# Altium schematic sheet Encoders.SchDoc: Title
size A4; Date: *******; ApprovedBy: *******; CheckedBy: Yasiru Banayake; Author: *******; CompanyName: *******; DrawnBy: Name; Engineer: *******; Organization: *******; Address1: *******; Address2: *******; Address3: *******; Address4: *******; DocumentNumber: Doc Num; Revision: *******; SheetNumber: 4; SheetTotal: 11; Subtitle: Encoder JST; Project: Resturant Robot; VersionRevision: III; TotalSheet: 11; CurrentTime: *******; CurrentDate: *******; Time: *******; DocumentFullPathAndName: *******; DocumentName: *******; ModifiedDate: *******; ImagePath: *******; ProjectName: *******; Application_BuildNumber: *******
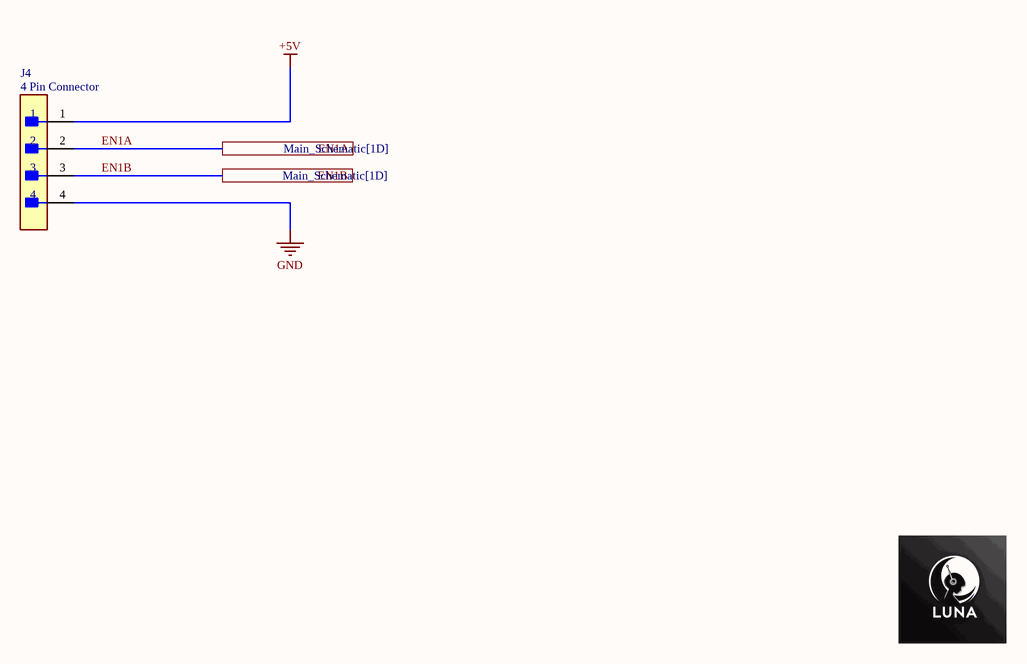
[diagram p0: Encoders.SchDoc]

## Parts
J4  4 Pin Connector  [FP-B4B-XH-A_LF_SN-MFG]

## Ports
EN1A (see Main_Schematic[1D]), EN1B (see Main_Schematic[1D])

## Nets
+5V: J4.1
GND: J4.4
EN1A: J4.2 ; port EN1A
EN1B: J4.3 ; port EN1B

## Notes on the sheet
- Title:
- Drawn By:
- Page Contents:
- Checked By:
- Subtitle:
- University Of Moratuwa
- Moratuwa
- Size:
- Date:
- File:
- Email:
- A4
- lasithnawanjaan123@gmail.com
- Lasith Haputhanthri
- Number:
- Time:
- Revision:
- Sheet
- of
- Katubedda
- 10500
- Sri Lanka

## Library data of the parts
J4 = CMP-17439-000250-1: CONN HEADER VERT 4POS 2.5MM; Number of Contacts: 4; Contact Resistance: 20mR; Voltage Rating: 250V; Max Current Rating: 3A; Gender: Male; Wire/Cable Gauge: 22AWG; Mated Stacking Heights: 9.8mm; Insulation Resistance: 1GR; Orientation: Straight; Contact Type: Male Pin; Contact Finish - Mating: TIN; Series: XH; Max Voltage Rating (AC): 250V; Lead Pitch: 2.5mm; Contact Shape: Square; Insulation Color: Natural; Termination: Solder; Lead Free: Lead Free; Voltage Rating (AC): 250V; Number of Rows: 1; Flammability Rating: UL94 V-0; Number of Positions: 4; Max Operating Temperature: 85°C; Package Quantity: 500; Mount: Through Hole; REACH SVHC: No SVHC; Connector Type: Header; Insulation Material: Nylon; Fastening Type: Detent; Min Operating Temperature: -25°C; Housing Color: White; Packaging: Bulk; Contact Plating: Tin; Contact Material: Brass; Max Voltage Rating (DC): 250V; Housing Material: Polyamide; Color: Natural; Material: Polyamide; Pitch: 2.5mm; Depth: 5.75mm; Current Rating: 3A; Length: 12.4mm